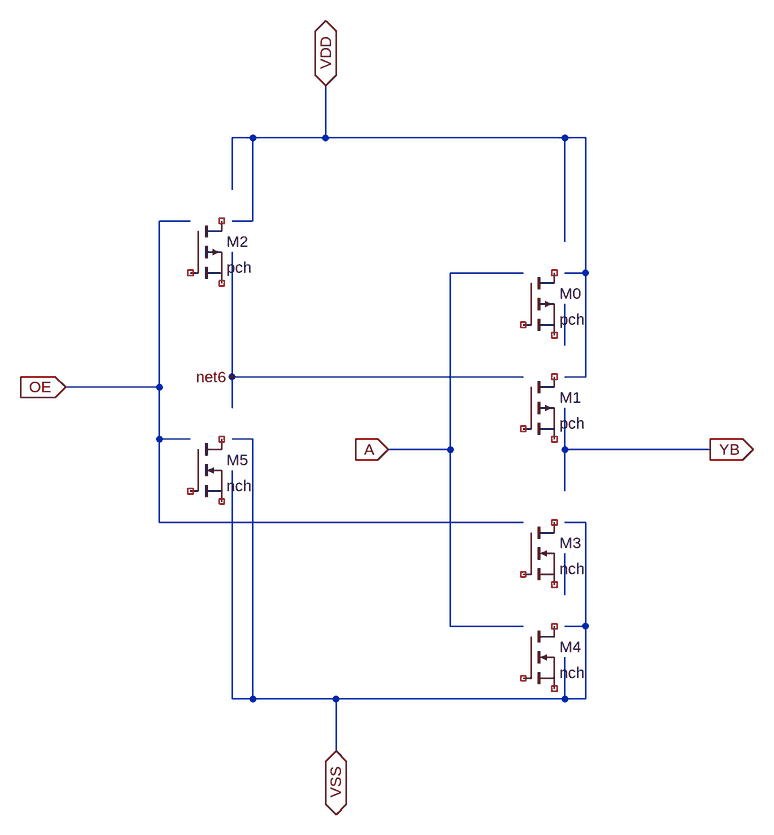
[diagram p0: schematic cinv.asc]
cinv.asc, the LTspice schematic file:
Version 4
SHEET 1 1168 1216
WIRE 592 656 688 656
WIRE 688 928 688 656
WIRE 688 384 800 384
WIRE 688 656 688 384
WIRE 688 928 800 928
WIRE 864 496 864 432
WIRE 864 880 864 816
WIRE 384 304 384 176
WIRE 384 176 496 176
WIRE 352 304 384 304
WIRE 496 176 496 96
WIRE 496 176 864 176
WIRE 864 384 896 384
WIRE 896 384 896 176
WIRE 864 336 864 176
WIRE 352 256 352 176
WIRE 352 176 384 176
WIRE 896 544 896 384
WIRE 864 544 896 544
WIRE 864 176 896 176
WIRE 240 768 240 640
WIRE 240 768 800 768
WIRE 96 560 240 560
WIRE 240 560 240 304
WIRE 240 640 288 640
WIRE 240 640 240 560
WIRE 240 304 288 304
WIRE 352 544 800 544
WIRE 352 592 352 544
WIRE 352 544 352 352
WIRE 864 656 1088 656
WIRE 864 656 864 592
WIRE 864 720 864 656
WIRE 352 640 384 640
WIRE 384 1040 512 1040
WIRE 352 1040 352 688
WIRE 512 1040 512 1120
WIRE 512 1040 864 1040
WIRE 864 928 896 928
WIRE 896 928 896 768
WIRE 864 1040 896 1040
WIRE 896 1040 896 928
WIRE 864 768 896 768
WIRE 352 1040 384 1040
WIRE 384 1040 384 640
WIRE 864 1040 864 976
FLAG 352 544 net6
SYMBOL NMOS 288 640 R0
SYMATTR InstName M5
SYMATTR Value nch
SYMATTR Value2 w=2u l=1u
SYMBOL NMOS 800 928 R0
SYMATTR InstName M4
SYMATTR Value nch
SYMATTR Value2 w=2u l=1u
SYMBOL NMOS 800 768 R0
SYMATTR InstName M3
SYMATTR Value nch
SYMATTR Value2 w=2u l=1u
SYMBOL PMOS 288 304 R0
SYMATTR InstName M2
SYMATTR Value pch
SYMATTR Value2 w=6u l=1u
SYMBOL PMOS 800 544 R0
SYMATTR InstName M1
SYMATTR Value pch
SYMATTR Value2 w=6u l=1u
SYMBOL PMOS 800 384 R0
SYMATTR InstName M0
SYMATTR Value pch
SYMATTR Value2 w=6u l=1u
FLAG 1088 656 YB
IOPIN 1088 656 Out
FLAG 512 1120 VSS
IOPIN 512 1120 BiDir
FLAG 496 96 VDD
IOPIN 496 96 BiDir
FLAG 96 560 OE
IOPIN 96 560 In
FLAG 592 656 A
IOPIN 592 656 In

The netlist it stands for:
* cinv.asc
* M5: nch w=2u l=1u (symbol NMOS not certain, pin order unknown); nets seen at it: 
* M4: nch w=2u l=1u (symbol NMOS not certain, pin order unknown); nets seen at it: 
* M3: nch w=2u l=1u (symbol NMOS not certain, pin order unknown); nets seen at it: 
* M2: pch w=6u l=1u (symbol PMOS not certain, pin order unknown); nets seen at it: 
* M1: pch w=6u l=1u (symbol PMOS not certain, pin order unknown); nets seen at it: 
* M0: pch w=6u l=1u (symbol PMOS not certain, pin order unknown); nets seen at it: 
.backanno
.end